# Altium schematic sheet PWM Outputs.SchDoc
size A4; SheetNumber: 8; SheetTotal: 9
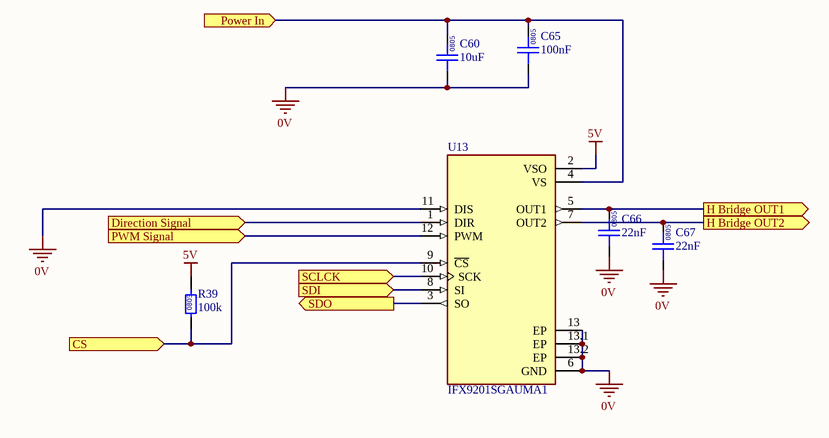
[diagram p0: PWM Outputs.SchDoc]

## Parts
C60  10uF  [0805]
C65  100nF  [0805]
C66  22nF  [0805]
C67  22nF  [0805]
R39  100k  [0805]
U13  IFX9201SGAUMA1  [CONV_IFX9201SGAUMA1]

## Ports
CS (in), Direction Signal (in), H Bridge OUT1 (out), H Bridge OUT2 (out), Power In (in), PWM Signal (in), SCLCK (in), SDI (in), SDO (out)

## Nets
0V: C60.1 C65.1 C66.1 C67.1 U13.6(GND) U13.11(DIS) U13.13(EP) U13.13.1(EP) U13.13.2(EP)
5V: R39.2 U13.2(VSO)
CS: R39.1 U13.9(~{CS}) ; port CS
Direction Signal: U13.1(DIR) ; port Direction Signal
H Bridge OUT1: C66.2 U13.5(OUT1) ; port H Bridge OUT1
H Bridge OUT2: C67.2 U13.7(OUT2) ; port H Bridge OUT2
Power In: C60.2 C65.2 U13.4(VS) ; port Power In
PWM Signal: U13.12(PWM) ; port PWM Signal
SCLCK: U13.10(SCK) ; port SCLCK
SDI: U13.8(SI) ; port SDI
SDO: U13.3(SO) ; port SDO

## Notes on the sheet
- (in symbol GCM21B5C1H223JA16L) 0805
- (in symbol GCM21BR71H104KA37L) 0805
- (in symbol GRM21BR6YA106KE43L) 0805
- (in symbol RC0805FR07100KL) 0805

## Library data of the parts
C60 = GRM21BR6YA106KE43L: Manufacturer: muRata; Rated Voltage: 50V; Tolerance: 10%; Material: MLCC; Temperature Rating: X5R; Part Number: GRM21BR6YA106KE43L; Value: 10uF; Digikey Part Number: 490-10514-6-ND
C65 = GCM21BR71H104KA37L: Manufacturer: muRata; Rated Voltage: 50V; Tolerance: ±10%; Material: MLCC; Temperature Rating: X7R; Part Number: GCM21BR71H104KA37L; Value: 100nF; Digikey Part Number: 490-6064-1-ND
C66 C67 = GCM21B5C1H223JA16L: Manufacturer: muRata; Rated Voltage: 50V; Tolerance: ±5%; Material: MLCC; Temperature Rating: C0G, NP0; Part Number: GCM21B5C1H223JA16L; Value: 22nF; Digikey Part Number: 490-5318-1-ND
R39 = RC0805FR07100KL: Manufacturer: YAGEO; Tolerance: 0.01; Rated Power: 0.125W; Part Number: RC0805FR07100KL; Value: 100k; Material: FR-07; Digikey Part Number: 311-100KCRCT-ND
U13 = IFX9201SGAUMA1: IC HALF BRIDGE DRIVER 6A 12DSO; MF: Infineon Technologies; Package: BSOP-12 Infineon; Check_prices: https://www.snapeda.com/parts/IFX9201SGAUMA1/Infineon+Technologies/view-part/?ref=eda; Value: *; Purchase-URL: https://pricing.snapeda.com/search/part/IFX9201SGAUMA1/?ref=eda; Availability: In Stock; SnapEDA_Link: https://www.snapeda.com/parts/IFX9201SGAUMA1/Infineon+Technologies/view-part/?ref=snap; MP: IFX9201SGAUMA1; Price: None; Part Number: IFX9201SGAUMA1; Digikey Part Number: IFX9201SGAUMA1TR-ND; Digikey Link: https://www.digikey.com.au/en/products/detail/infineon-technologies/IFX9201SGAUMA1/5415542; Manufacturer: Infineon Technologies